# EAGLE board AniBike_v2.6_MainBoard (EAGLE 5.08)
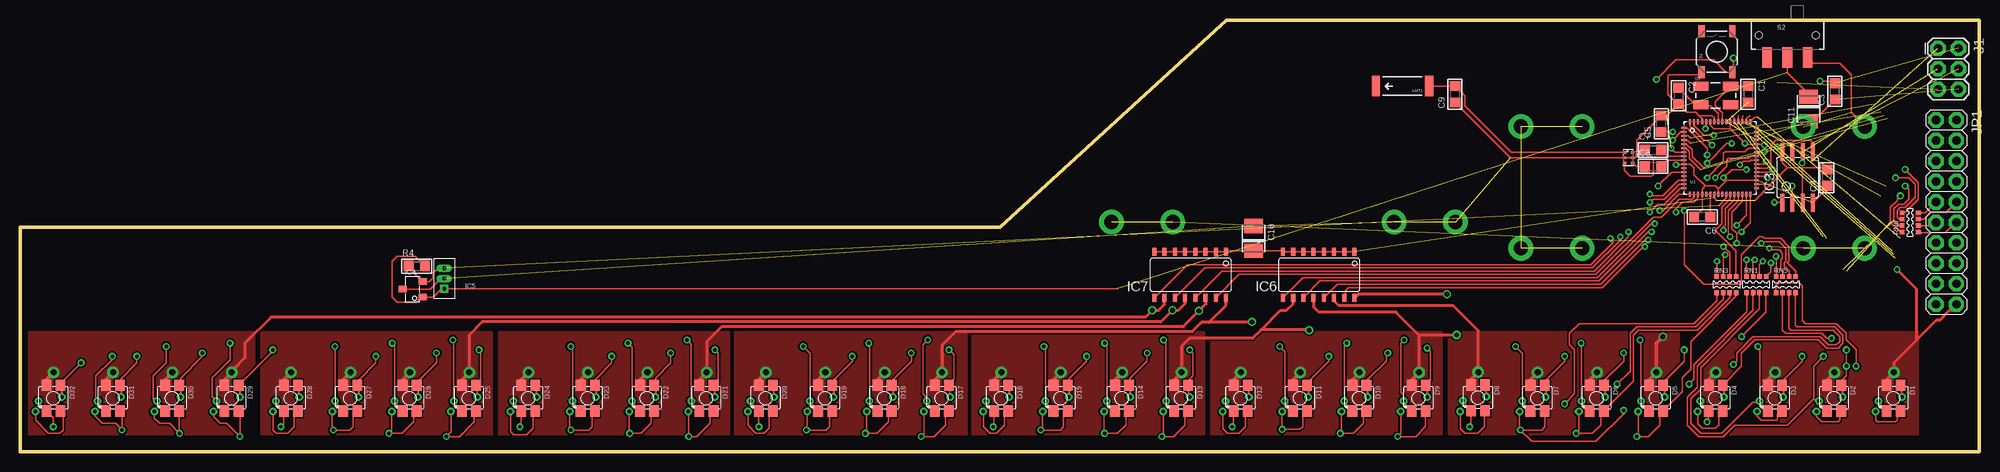
[diagram p5: board, top side]
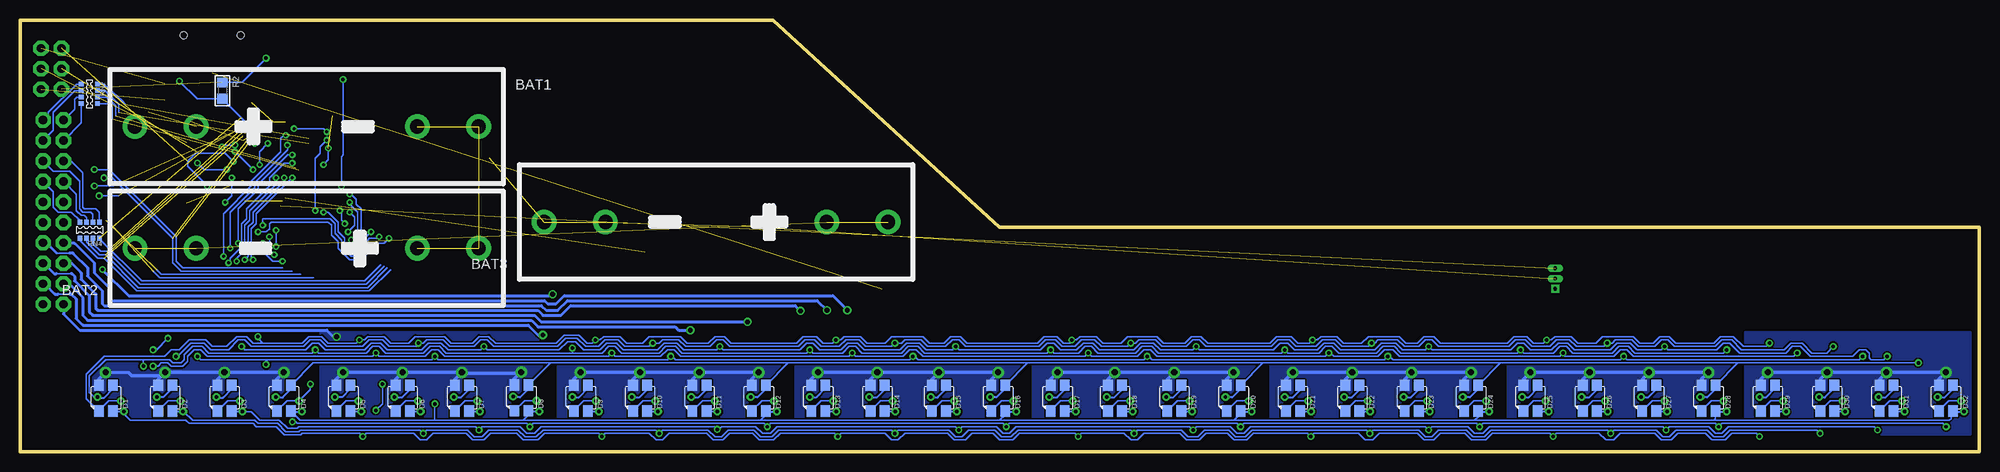
[diagram p6: board, bottom side, seen from below]

Size 243.13 x 53.54 mm. Coordinates in mm from the lower left corner, seen from the top.
Outline: 243.13,0 0,0 0,27.84 121.56,27.84 149.71,53.54 243.13,53.54 243.13,0
Copper layers (1*16): Top 0.035mm / dielectric 1.5mm / Bottom 0.035mm
Design rules "default *": minimum track width 7mil, minimum drill 15mil, track to track 8mil, track to pad 8mil, pad to pad 8mil, via to via 8mil, smd to smd 8mil, copper to edge 10mil, drill to drill 15mil, minimum pad ring 10mil, minimum via ring 8mil, stop-mask expansion 4mil, vias tented up to drill 0mil, thermal gap 10mil

## Footprints (pad centres in the part's own frame; a part is rotated, then mirrored left to right if it is on the bottom)
ANTENNA-CHIP5 = smd 1.016 x 2.54: FEED -3.302,0; NC 3.302,0
BALUN = smd 0.27 x 0.4: 1 -0.7,-0.5; 2 -0.05,-0.5; 3 0.6,-0.5; 4 0.6,0.5; 5 -0.05,0.5; 6 -0.7,0.5
BATTERY_AAA = drill 1.778 pad 3.048 round: MINUS1 21.336,0; MINUS2 13.716,0; PLUS1 -21.336,0; PLUS2 -13.716,0
C0805 = smd 1.2 x 1.3: 1 -1.016,0; 2 1.016,0
C3528-21/T = smd 1.778 x 2.286: + 1.524,0; - -1.524,0
LED1210_DS = drill 0.432 pad 0.889 round: 1 -1.913,-0.353; 2 -2.25,-1.68; 3 1,0.15 | smd 1.2 x 1.4 bottom: 1_BOTTOM 0.85,-1.6; 2_BOTTOM -0.9,-1.6; 3_BOTTOM -0.9,1.6; 4_BOTTOM 0.85,1.6 | smd 1.2 x 1.4: 1_TOP -0.9,-1.6; 2_TOP 0.85,-1.6; 3_TOP 0.85,1.6; 4_TOP -0.9,1.6 | drill 0.762 pad 1.422 round: 4 0,3.2
SOIC8 = smd 0.5 x 2.2: 1 -1.905,-3.154; 2 -0.645,-3.154; 3 0.625,-3.154; 4 1.895,-3.154; 5 1.905,3.154; 6 0.635,3.154; 7 -0.635,3.154; 8 -1.905,3.154
HALL_SENSOR_SE = smd 1 x 0.8: 1 1.15,-1; 2 1.15,0.9; 3 -1.35,-0.05
HALL_SENSOR_UA = drill 0.45 square: 1 0,-1.27 | drill 0.45 long: 2 0,0; 3 0,1.27
SOIC16 = smd 0.5 x 1: 1 -4.41,-2.84; 2 -3.14,-2.84; 3 -1.87,-2.84; 4 -0.6,-2.84; 5 0.67,-2.84; 6 1.94,-2.84; 7 3.21,-2.84; 8 4.48,-2.84; 9 4.48,2.84; 10 3.21,2.84; 11 1.94,2.84; 12 0.67,2.84; 13 -0.6,2.84; 14 -1.87,2.84; 15 -3.14,2.84; 16 -4.41,2.84
2X3 = drill 1.016 pad 1.88 octagon: 1 0,0; 2 0,2.54; 3 2.54,0; 4 2.54,2.54; 5 5.08,0; 6 5.08,2.54
2X10 = drill 1.016 pad 1.88 octagon: 1 -11.43,-1.27; 2 -11.43,1.27; 3 -8.89,-1.27; 4 -8.89,1.27; 5 -6.35,-1.27; 6 -6.35,1.27; 7 -3.81,-1.27; 8 -3.81,1.27; 9 -1.27,-1.27; 10 -1.27,1.27; 11 1.27,-1.27; 12 1.27,1.27; 13 3.81,-1.27; 14 3.81,1.27; 15 6.35,-1.27; 16 6.35,1.27; 17 8.89,-1.27; 18 8.89,1.27; 19 11.43,-1.27; 20 11.43,1.27
CRYSTAL-SMD-5X3 = smd 1.9 x 1.1: 1 -1.85,-1.15; 2 1.85,-1.15; 3 1.85,1.15; 4 -1.85,1.15
R0805 = smd 1.2 x 1.3: 1 -1.016,0; 2 1.016,0
YCTC164 = smd 0.559 x 0.6: P$1 -1.2,-1.003; P$2 -0.4,-1.003; P$3 0.4,-1.003; P$4 1.2,-1.003; P$5 1.2,1.003; P$6 0.4,1.003; P$7 -0.4,1.003; P$8 -1.2,1.003
TACTILE_SWITCH_SMD = smd 1.524 x 0.762: 1 -2.54,1.905; 2 2.54,1.905; 3 -2.54,-1.905; 4 2.54,-1.905
SWITCH-SPDT-SMD = smd 1.2 x 2.5: 1 -2.5,-2.75; 2 0,-2.75; 3 2.5,-2.75 | hole 0.9: -3.55,0; 3.55,0
QFN-64 = smd 0.6 x 0.25: 1 -4.5,3.75; 2 -4.5,3.25; 3 -4.5,2.75; 4 -4.5,2.25; 5 -4.5,1.75; 6 -4.5,1.25; 7 -4.5,0.75; 8 -4.5,0.25; 9 -4.5,-0.25; 10 -4.5,-0.75; 11 -4.5,-1.25; 12 -4.5,-1.75; 13 -4.5,-2.25; 14 -4.5,-2.75; 15 -4.5,-3.25; 16 -4.5,-3.75; 33 4.5,-3.75; 34 4.5,-3.25; 35 4.5,-2.75; 36 4.5,-2.25; 37 4.5,-1.75; 38 4.5,-1.25; 39 4.5,-0.75; 40 4.5,-0.25; 41 4.5,0.25; 42 4.5,0.75; 43 4.5,1.25; 44 4.5,1.75; 45 4.5,2.25; 46 4.5,2.75; 47 4.5,3.25; 48 4.5,3.75 | smd 0.25 x 0.6: 17 -3.75,-4.5; 18 -3.25,-4.5; 19 -2.75,-4.5; 20 -2.25,-4.5; 21 -1.75,-4.5; 22 -1.25,-4.5; 23 -0.75,-4.5; 24 -0.25,-4.5; 25 0.25,-4.5; 26 0.75,-4.5; 27 1.25,-4.5; 28 1.75,-4.5; 29 2.25,-4.5; 30 2.75,-4.5; 31 3.25,-4.5; 32 3.75,-4.5; 49 3.75,4.5; 50 3.25,4.5; 51 2.75,4.5; 52 2.25,4.5; 53 1.75,4.5; 54 1.25,4.5; 55 0.75,4.5; 56 0.25,4.5; 57 -0.25,4.5; 58 -0.75,4.5; 59 -1.25,4.5; 60 -1.75,4.5; 61 -2.25,4.5; 62 -2.75,4.5; 63 -3.25,4.5; 64 -3.75,4.5

## Placement (x,y rotation side)
ANT1  ANTENNA2SMD5  [ANTENNA-CHIP5]  171.55,45.36 180 top
B1  BALUN0805  [BALUN]  199.59,36.42 270 top
BAT1  BATTERY_AAA  [BATTERY_AAA]  207.57,40.34 0 bottom
BAT2  BATTERY_AAA  [BATTERY_AAA]  207.57,25.25 180 bottom
BAT3  BATTERY_AAA  [BATTERY_AAA]  156.77,28.5 180 bottom
C1  12pF  [C0805]  214.43,44.35 270 top
C2  12pF  [C0805]  205.79,44.15 270 top
C3  1uF  [C0805]  225.2,44.7 90 top
C4  1uF  [C0805]  224.21,34.01 90 top
C5  1uF  [C0805]  203.66,40.69 90 top
C6  1uF  [C0805]  208.74,29.11 180 top
C7  22pF  [C0805]  202.64,37.44 0 top
C8  22pF  [C0805]  202.64,35.41 0 top
C9  0.47pF  [C0805]  178.05,44.35 90 top
C10  22uF  [C3528-21/T]  153.06,26.47 270 top
C11  47uF  [C3528-21/T]  221.95,42.52 90 top
D1  LED_RGB_DS  [LED1210_DS]  232.51,6.65 0 top
D2  LED_RGB_DS  [LED1210_DS]  225.15,6.65 0 top
D3  LED_RGB_DS  [LED1210_DS]  217.78,6.65 0 top
D4  LED_RGB_DS  [LED1210_DS]  210.41,6.65 0 top
D5  LED_RGB_DS  [LED1210_DS]  203.05,6.65 0 top
D6  LED_RGB_DS  [LED1210_DS]  195.68,6.65 0 top
D7  LED_RGB_DS  [LED1210_DS]  188.32,6.65 0 top
D8  LED_RGB_DS  [LED1210_DS]  180.95,6.68 0 top
D9  LED_RGB_DS  [LED1210_DS]  173.58,6.65 0 top
D10  LED_RGB_DS  [LED1210_DS]  166.22,6.65 0 top
D11  LED_RGB_DS  [LED1210_DS]  158.85,6.65 0 top
D12  LED_RGB_DS  [LED1210_DS]  151.49,6.65 0 top
D13  LED_RGB_DS  [LED1210_DS]  144.12,6.65 0 top
D14  LED_RGB_DS  [LED1210_DS]  136.75,6.65 0 top
D15  LED_RGB_DS  [LED1210_DS]  129.13,6.65 0 top
D16  LED_RGB_DS  [LED1210_DS]  121.77,6.65 0 top
D17  LED_RGB_DS  [LED1210_DS]  114.4,6.65 0 top
D18  LED_RGB_DS  [LED1210_DS]  107.29,6.65 0 top
D19  LED_RGB_DS  [LED1210_DS]  99.92,6.65 0 top
D20  LED_RGB_DS  [LED1210_DS]  92.56,6.65 0 top
D21  LED_RGB_DS  [LED1210_DS]  85.19,6.65 0 top
D22  LED_RGB_DS  [LED1210_DS]  77.83,6.65 0 top
D23  LED_RGB_DS  [LED1210_DS]  70.46,6.65 0 top
D24  LED_RGB_DS  [LED1210_DS]  63.09,6.65 0 top
D25  LED_RGB_DS  [LED1210_DS]  55.73,6.65 0 top
D26  LED_RGB_DS  [LED1210_DS]  48.36,6.65 0 top
D27  LED_RGB_DS  [LED1210_DS]  41,6.65 0 top
D28  LED_RGB_DS  [LED1210_DS]  33.63,6.65 0 top
D29  LED_RGB_DS  [LED1210_DS]  26.26,6.65 0 top
D30  LED_RGB_DS  [LED1210_DS]  18.9,6.65 0 top
D31  LED_RGB_DS  [LED1210_DS]  11.53,6.65 0 top
D32  LED_RGB_DS  [LED1210_DS]  4.17,6.65 0 top
IC3  AT26DF321  [SOIC8]  220.57,34.04 0 top
IC4  HALL_SENSORSMT  [HALL_SENSOR_SE]  48.82,20.22 0 top
IC5  HALL_SENSORTH  [HALL_SENSOR_UA]  52.63,21.49 0 top
IC6  MMPQ2222  [SOIC16]  161.19,21.95 180 top
IC7  MMPQ2222  [SOIC16]  145.24,21.95 180 top
J1  AVR_SPI_PRG_6PTH  [2X3]  238,50.04 270 top
JP1  [2X10]  239.01,29.72 270 top
Q1  16MHz  [CRYSTAL-SMD-5X3]  210.41,44.2 0 top
R2  10K  [R0805]  218.03,44.81 270 bottom
R4  10K  [R0805]  49.23,23.01 0 top
RN1  RESISTOR_ARR4  [YCTC164]  215.44,20.73 0 top
RN2  RESISTOR_ARR4  [YCTC164]  234.54,44.4 270 bottom
RN3  RESISTOR_ARR4  [YCTC164]  211.73,20.73 0 top
RN4  RESISTOR_ARR4  [YCTC164]  234.49,27.48 180 bottom
RN5  RESISTOR_ARR4  [YCTC164]  219.13,20.73 0 top
RN6  RESISTOR_ARR4  [YCTC164]  234.54,28.45 90 top
S1  SWITCH-MOMENTARY-2SMD  [TACTILE_SWITCH_SMD]  210.57,49.63 90 top
S2  [SWITCH-SPDT-SMD]  219.3,51.66 0 top
U1  ATMEGA128RFA1  [QFN-64]  210.97,36.42 0 top

## Tracks (layer width: path | path; a pad name or v marks a point on that pad's centre or on a via)
+3V3  (via drill 0.38, 0.43)  (3 unrouted)
  Top 0.203: IC7.8 IC7.7 IC7.6 IC7.5 IC7.4 IC7.3 IC7.2 IC7.1 149.8,24.94 C10.+ 156.55,24.94 IC6.8 IC6.7 IC6.6 IC6.5 IC6.4 IC6.3 IC6.2 IC6.1 | C4.2 224.03,35.2 221.13,35.2 | 219.3,35.2 221.13,35.2 | 219.3,35.2 218.67,35.84 IC3.8 218.08,37.77 v218.08,37.85 | IC3.3 221.13,30.95 221.13,35.2 | U1.34 217.27,33.17 | 219.3,35.2 217.27,33.17 | 212.22,40.05 U1.54 | 212.22,40.05 v214.02,38.25 214.1,38.17 U1.44 216.33,38.17 v216.46,38.05 | 212.22,40.05 212.19,40.08 210.16,40.08 209.72,40.52 U1.59 | U1.23 210.22,31.48 210.57,31.14 | 217.27,33.17 215.24,31.14 | v223.37,45.97 224.94,45.97 C3.2
  Bottom 0.203: v214.02,38.25 214.02,39.78 R2.2 221.18,43.79 v223.37,45.97 | v216.46,38.05 217.88,38.05 v218.08,37.85
+5V  (1 unrouted)
  Top 0.203: 136.19,20.22 IC5.1 52.32,20.22 51.26,19.15 50.04,19.15 IC4.1 49.9,19.22 49.22,18.54 46.79,18.54 46.18,19.15 46.18,23.62 46.79,24.23 49.02,24.23 R4.2 | S2.2 219.3,46.99 221.94,44.35 C11.+
CS  (via drill 0.38)
  Top 0.203: U1.36 216.68,34.17 v216.86,33.99 | v217.68,30.94 218.61,30.94 IC3.1
  Bottom 0.203: v216.86,33.99 216.86,31.75 v217.68,30.94
GND  (via drill 0.38)  (11 unrouted)
  Top 0.203: IC4.3 50.85,20.17 52.17,21.49 IC5.2 | C2.2 206.81,42.11 207.92,42.11 208.33,41.71 | 208.33,41.71 208.72,41.32 U1.61 | S1.1 208.36,46.79 204.67,46.79 204.47,46.58 204.47,44.35 205.69,43.13 C2.2 | C4.1 224.21,32.62 IC3.4 | C9.1 184.91,36.47 B1.2 B1.5 200.46,36.47 200.61,36.63 200.61,38.66 C5.2 204.37,41.71 C2.2 | 210.72,32.61 U1.24 | 210.72,32.61 210.36,32.97 209.14,32.97 | 209.14,32.97 208.72,32.55 U1.20 208.72,30.11 C6.2 | 209.14,32.97 207.72,34.39 207.72,35.2 207.25,35.67 U1.10 206.41,35.61 v205.49,35.61 | U1.35 211.79,33.67 210.72,32.61 | U1.58 210.22,41.44 209.96,41.71 208.33,41.71 | C11.- 222.5,41 C3.1 | U1.7 205.35,37.17 v204.88,37.64
  Bottom 0.203: v204.88,37.64 204.88,36.22 v205.49,35.61
INT_SENSOR  (1 unrouted)
  Top 0.203: IC5.3 52.48,22.61 51.66,22.61 51.26,22.2 51.26,21.59 50.79,21.12 IC4.2 48.21,22.88 R4.1 | U1.26 211.72,31.48 210.77,30.53
L1_B1  (via drill 0.38)
  Top 0.203: 217.93,22.45 RN5.P$8 217.93,24.19 v217.88,24.23 | U1.63 207.72,40.49 208.94,39.27 v210.16,39.27
  Bottom 0.203: v210.16,39.27 210.36,39.27 210.77,38.86 210.77,37.24 214.43,33.58 214.43,32.97 217.88,29.51 v217.88,24.23
L1_B1_LED  (via drill 0.43)
  Top 0.203: 204.05,8.1 204.05,8.77 206.5,11.23 v206.5,12.65 | D29.3_TOP 31.34,12.48 v31.34,12.65 | v56.95,12.65 57.15,12.45 57.15,8.79 56.62,8.25 D25.3_TOP 56.73,8.1 D25.3 | v86.21,12.65 86.61,12.24 86.61,8.99 86.04,8.42 D21.3_TOP 86.19,8.1 D21.3 | v115.26,12.65 115.87,12.04 115.87,8.99 115.25,8.37 D17.3_TOP 115.4,8.1 D17.3 | v145.14,12.65 145.54,12.24 145.54,9.4 144.97,8.83 D13.3_TOP 144.97,6.95 D13.3 | v174.6,12.85 175.01,12.45 175.01,8.99 174.43,8.42 D9.3_TOP | D1.3_TOP 233.4,8.25 | v227.84,10.62 227.84,12.65 226.62,13.87 226.62,14.68 225.4,15.9 221.54,15.9 221.13,16.31 221.13,20.57 220.73,20.98 218.26,20.98 217.88,20.57 217.88,20.17 RN5.P$1
  Top 0.254: D1.3 233.51,8.1 D1.3_TOP | D5.3 204.05,8.1 D5.3_TOP | D9.3 174.58,8.1 D9.3_TOP | D29.3_TOP 27.26,8.1 D29.3
  Bottom 0.203: v31.34,12.65 31.75,12.24 42.72,12.24 43.54,13.06 44.75,13.06 45.57,12.24 50.44,12.24 51.26,13.06 52.07,13.06 52.88,12.24 56.54,12.24 v56.95,12.65 57.35,12.24 71.78,12.24 72.59,13.06 74.02,13.06 74.83,12.24 79.5,12.24 80.31,13.06 81.13,13.06 81.94,12.24 85.8,12.24 v86.21,12.65 86.61,12.24 101.85,12.24 102.67,13.06 103.89,13.06 104.7,12.24 109.37,12.24 110.18,13.06 111,13.06 111.81,12.24 114.86,12.24 v115.26,12.65 115.67,12.24 130.91,12.24 131.72,13.06 132.94,13.06 133.76,12.24 138.63,12.24 139.45,13.06 140.26,13.06 141.07,12.24 144.73,12.24 v145.14,12.65 145.54,12.24 160.98,12.24 161.8,13.06 163.02,13.06 163.83,12.24 168.5,12.24 169.32,13.06 170.13,13.06 170.94,12.24 174.6,12.24 | 174.6,12.24 v174.6,12.85 | 174.6,12.24 190.25,12.24 191.06,13.06 192.28,13.06 193.09,12.24 197.76,12.24 198.58,13.06 199.39,13.06 200.2,12.24 206.1,12.24 v206.5,12.65 206.91,12.24 219.71,12.24 220.52,13.06 221.74,13.06 222.76,12.04 222.76,11.43 223.16,11.02 224.18,11.02 224.59,11.43 227.84,11.43 | 227.84,11.43 232.51,11.43 234.54,9.4 234.54,7.37 233.98,6.8 D1.3 | 227.84,11.43 v227.84,10.62
  Bottom 0.254: D1.3_BOTTOM 231.61,7.78 232.69,6.71 233.41,6.71 D1.3 | D5.3_BOTTOM 202.15,7.78 203.12,6.81 D5.3 | D9.3_BOTTOM 172.68,7.86 173.79,6.76 174.53,6.76 D9.3 | D13.3_BOTTOM 143.22,7.86 144.32,6.76 145.07,6.76 D13.3 | D17.3_BOTTOM 113.5,7.71 114.45,6.76 115.35,6.76 D17.3 | D21.3_BOTTOM 84.29,7.66 85.19,6.76 86.14,6.76 D21.3 | D25.3_BOTTOM 54.83,7.86 55.93,6.76 56.68,6.76 D25.3 | D29.3_BOTTOM 25.36,7.86 26.47,6.76 27.21,6.76 D29.3
L1_B2  (via drill 0.38)
  Top 0.203: RN5.P$7 218.73,22.37 218.49,22.61 218.49,23.83 218.69,24.03 218.69,24.64 218.29,25.04 217.27,25.04 v217.07,25.25 | U1.64 207.22,40.38 208.94,38.66 209.35,38.66 v209.96,38.05
  Bottom 0.203: v209.96,38.05 209.96,37.44 214.02,33.38 214.02,32.77 217.07,29.72 v217.07,25.25
L1_B2_LED  (via drill 0.43)
  Top 0.203: 19.9,8.1 19.9,9.13 22.61,11.84 v22.61,12.24 | 49.36,8.1 49.36,8.72 51.66,11.02 v51.66,12.24 | 78.83,8.1 78.83,9.13 80.72,11.02 v80.72,12.24 | 108.29,8.1 108.29,8.92 110.59,11.23 v110.59,12.24 | 137.75,8.1 137.75,9.13 139.85,11.23 v139.85,12.24 | 167.22,8.1 167.22,8.92 169.52,11.23 169.52,12.04 v169.72,12.24 | 196.68,8.1 196.68,8.92 198.98,11.23 v198.98,12.24 | 226.15,8.92 226.62,9.4 v226.62,10.62 v226.62,12.65 | RN5.P$2 218.69,20.1 218.69,15.09 219.1,14.68 223.57,14.68 224.18,14.07 v224.79,14.07
  Top 0.254: 226.15,8.1 D2.3 | 226.15,8.1 D2.3_TOP | D6.3 196.68,8.1 D6.3_TOP | D10.3 167.22,8.1 D10.3_TOP | D14.3 137.75,8.1 D14.3_TOP | D18.3 108.29,8.1 D18.3_TOP | D22.3 78.83,8.1 D22.3_TOP | D26.3 49.36,8.1 D26.3_TOP | D30.3 19.9,8.1 D30.3_TOP | 226.15,8.92 226.15,8.1
  Bottom 0.203: v22.61,12.24 23.01,11.84 42.93,11.84 43.74,12.65 44.55,12.65 45.36,11.84 51.46,11.84 51.66,12.04 v51.66,12.24 52.07,11.84 71.98,11.84 72.8,12.65 73.81,12.65 74.62,11.84 80.11,11.84 80.52,12.24 v80.72,12.24 81.13,11.84 102.06,11.84 102.87,12.65 103.68,12.65 104.5,11.84 110.18,11.84 v110.59,12.24 111,11.84 131.11,11.84 131.93,12.65 132.74,12.65 133.55,11.84 139.45,11.84 v139.85,12.24 140.26,11.84 161.19,11.84 162,12.65 162.81,12.65 163.63,11.84 169.32,11.84 v169.72,12.24 170.13,11.84 190.45,11.84 191.26,12.65 192.07,12.65 192.89,11.84 198.58,11.84 v198.98,12.24 199.39,11.84 219.91,11.84 220.73,12.65 221.54,12.65 222.35,11.84 222.35,11.23 222.96,10.62 224.38,10.62 224.79,11.02 225.6,11.02 226.01,10.62 v226.62,10.62 | v224.79,14.07 226.21,12.65 v226.62,12.65
  Bottom 0.254: D2.3_BOTTOM 224.25,7.89 225.32,6.81 D2.3 | D6.3_BOTTOM 194.78,7.71 195.73,6.76 196.63,6.76 D6.3 | D10.3_BOTTOM 165.32,7.71 166.27,6.76 167.17,6.76 D10.3 | D14.3_BOTTOM 135.85,7.71 136.8,6.76 137.7,6.76 D14.3 | D18.3_BOTTOM 106.39,7.71 107.34,6.76 108.24,6.76 D18.3 | D22.3_BOTTOM 76.93,7.71 77.88,6.76 78.78,6.76 D22.3 | D26.3_BOTTOM 47.46,7.71 48.41,6.76 49.31,6.76 D26.3 | D30.3_BOTTOM 18,7.91 19.15,6.76 19.85,6.76 D30.3
L1_B3  (via drill 0.38)
  Top 0.203: RN5.P$6 219.53,22.38 218.9,23.01 218.9,23.42 219.1,23.62 219.1,25.25 218.29,26.06 216.26,26.06 v216.05,25.86 | U1.1 206.82,40.17 209.35,37.64 v209.35,36.83
  Bottom 0.203: v209.35,36.83 209.96,36.83 213.61,33.17 213.61,32.56 216.05,30.12 v216.05,25.86
L1_B3_LED  (via drill 0.43)
  Top 0.203: 12.53,8.1 12.53,9.08 14.48,11.02 v14.48,11.84 | 42,8.1 42,8.87 44.14,11.02 v44.14,11.84 | 71.46,8.1 71.46,9.08 73.41,11.02 v73.41,11.84 | 100.92,8.1 100.92,8.87 103.28,11.23 v103.28,11.84 | 130.13,8.1 130.13,9.03 132.33,11.23 v132.33,11.84 | 159.85,8.1 159.85,8.67 162.41,11.23 v162.41,11.84 | 189.32,8.1 189.32,8.87 191.67,11.23 v191.67,11.84 | 218.78,8.1 218.78,8.87 221.13,11.23 v221.13,11.84 | v212.6,10.82 213,11.23 213,12.24 215.04,14.27 223.37,14.27 224.38,13.26 225.4,13.26 225.81,13.67 225.81,14.27 224.99,15.09 219.71,15.09 219.51,15.29 219.51,20.11 RN5.P$3
  Top 0.254: D3.3 218.78,8.1 D3.3_TOP | D7.3 189.32,8.1 D7.3_TOP | D11.3 159.85,8.1 D11.3_TOP | D15.3 130.13,8.1 D15.3_TOP | D19.3 100.92,8.1 D19.3_TOP | D23.3 71.46,8.1 D23.3_TOP | D27.3 42,8.1 D27.3_TOP | D31.3 12.53,8.1 D31.3_TOP
  Bottom 0.203: v14.48,11.84 14.88,11.43 43.74,11.43 v44.14,11.84 44.55,11.43 72.8,11.43 73.2,11.84 v73.41,11.84 73.81,11.43 102.67,11.43 103.07,11.84 v103.28,11.84 103.68,11.43 131.72,11.43 132.13,11.84 v132.33,11.84 132.74,11.43 161.8,11.43 162.2,11.84 v162.41,11.84 162.81,11.43 191.26,11.43 v191.67,11.84 192.07,11.43 212.39,11.43 | 212.39,11.43 220.73,11.43 v221.13,11.84 | v212.6,10.82 212.6,11.23 212.39,11.43
  Bottom 0.254: D3.3_BOTTOM 216.88,7.78 217.96,6.71 218.68,6.71 D3.3 | D7.3_BOTTOM 187.42,7.76 188.42,6.76 189.27,6.76 D7.3 | D11.3_BOTTOM 157.95,7.76 158.95,6.76 159.8,6.76 D11.3 | D15.3_BOTTOM 128.23,7.81 129.29,6.76 130.08,6.76 D15.3 | D19.3_BOTTOM 99.02,7.76 100.02,6.76 100.87,6.76 D19.3 | D23.3_BOTTOM 69.56,7.76 70.56,6.76 71.41,6.76 D23.3 | D27.3_BOTTOM 40.1,7.76 41.1,6.76 41.95,6.76 D27.3 | D31.3_BOTTOM 10.63,7.76 11.63,6.76 12.48,6.76 D31.3
L1_B4  (via drill 0.38)
  Top 0.203: RN5.P$5 220.33,22.4 219.3,23.42 219.51,23.62 219.51,25.45 218.49,26.47 216.46,26.47 216.26,26.67 215.85,26.67 213.61,24.43 213.61,20.78 208.94,20.78 206.5,23.22 v206.5,29.92 | U1.2 206.09,39.67 v205.08,38.66
  Bottom 0.203: v206.5,29.92 206.5,36.42 205.89,37.03 205.89,37.85 v205.08,38.66
L1_B4_LED  (via drill 0.43)
  Top 0.203: 5.17,8.1 5.17,8.62 v7.57,11.02 | D4.3_TOP 213.61,10.61 213.61,12.24 215.24,13.87 223.16,13.87 224.18,12.85 225.6,12.85 226.21,13.46 226.21,14.48 225.2,15.49 220.52,15.49 220.32,15.7 220.32,20.12 RN5.P$4
  Top 0.254: D4.3 211.41,8.1 D4.3_TOP | D8.3 181.95,8.13 D8.3_TOP | D12.3 152.49,8.1 D12.3_TOP | D16.3 122.77,8.1 D16.3_TOP | D20.3 93.56,8.1 D20.3_TOP | D24.3 64.09,8.1 D24.3_TOP | D32.3 5.17,8.1 D32.3_TOP | D28.3_TOP 34.63,8.1 D28.3
  Bottom 0.203: 29.96,11.02 v7.57,11.02 | 29.96,11.02 D28.3_BOTTOM | 59.42,11.02 29.96,11.02 | 59.42,11.02 D24.3_BOTTOM | 88.89,11.02 59.42,11.02 | 88.89,11.02 D20.3_BOTTOM | 118.1,11.02 88.89,11.02 | 118.1,11.02 D16.3_BOTTOM | 147.82,11.02 118.1,11.02 | 147.82,11.02 D12.3_BOTTOM | 177.31,11.02 147.82,11.02 | 177.31,11.02 D8.3_BOTTOM | 177.31,11.02 206.74,11.02 D4.3_BOTTOM
  Bottom 0.254: D4.3_BOTTOM 209.51,7.78 210.54,6.76 211.36,6.76 D4.3 | D8.3_BOTTOM 180.05,7.81 181.1,6.76 181.88,6.76 D8.3 | D12.3_BOTTOM 150.59,7.81 151.64,6.76 152.44,6.76 D12.3 | D16.3_BOTTOM 120.87,7.86 121.97,6.76 122.72,6.76 D16.3 | D20.3_BOTTOM 91.66,7.81 92.71,6.76 93.51,6.76 D20.3 | D24.3_BOTTOM 62.19,7.81 63.25,6.76 64.04,6.76 D24.3 | D28.3_BOTTOM 32.73,7.81 33.78,6.76 34.58,6.76 D28.3 | D32.3_BOTTOM 3.27,7.81 4.32,6.76 5.12,6.76 D32.3
L1_G1
  Top 0.203: U1.27 212.22,31.37 211.18,30.33 211.18,28.3 210.36,27.48 212.93,24.91 RN3.P$5
L1_G1_LED  (via drill 0.43)
  Top 0.203: 27.18,5.23 27.28,5.13 v27.28,1.88 25.65,3.51 24.84,3.51 24.01,4.33 D29.2 | 27.18,5.23 27.11,5.3 | D25.2 53.48,2.47 v52.88,1.88 54.51,1.88 56.34,3.71 56.34,4.81 D25.2_TOP | D21.2 82.94,1.89 v82.96,1.88 83.97,1.88 85.6,3.51 85.6,4.61 D21.2_TOP | D17.2 112.15,2.22 v111.81,1.88 113.44,1.88 114.86,3.3 114.86,4.66 D17.2_TOP | D13.2 141.87,2.07 v141.68,1.88 143.1,1.88 144.53,3.3 144.53,4.61 D13.2_TOP | D9.2 171.33,2.27 v170.94,1.88 173.18,1.88 174.4,3.1 174.4,5.02 D9.2_TOP | D5.2 200.8,2.07 v200.61,1.88 202.03,1.88 203.45,3.3 203.45,4.61 D5.2_TOP 206.3,7.46 206.3,9.19 207.31,10.21 207.31,13.67 212.93,19.28 RN3.P$4 | D1.2_TOP 232.92,4.61 232.92,3.91 232.71,3.71 230.48,3.71 230.26,3.93 D1.2 | D29.2_TOP 27.11,5.17 27.18,5.23
  Bottom 0.203: v27.28,1.88 27.69,2.29 30.73,2.29 31.55,1.47 33.17,1.47 33.98,2.29 37.44,2.29 38.25,1.47 39.47,1.47 40.28,2.29 44.55,2.29 45.36,1.47 46.38,1.47 47.19,2.29 52.48,2.29 v52.88,1.88 53.29,2.29 60.4,2.29 61.21,1.47 63.04,1.47 63.86,2.29 66.9,2.29 67.72,1.47 68.94,1.47 69.75,2.29 74.42,2.29 75.23,1.47 76.25,1.47 77.06,2.29 82.55,2.29 v82.96,1.88 83.36,2.29 90.07,2.29 90.88,1.47 92.51,1.47 93.32,2.29 95.96,2.29 96.77,1.47 98.4,1.47 99.21,2.29 103.68,2.29 104.5,1.47 105.31,1.47 106.12,2.29 111.4,2.29 v111.81,1.88 112.22,2.29 119.13,2.29 119.94,1.47 121.56,1.47 122.38,2.29 125.02,2.29 125.83,1.47 127.25,1.47 128.07,2.29 133.35,2.29 134.16,1.47 134.98,1.47 135.79,2.29 141.27,2.29 v141.68,1.88 142.09,2.29 148.79,2.29 149.61,1.47 151.43,1.47 152.25,2.29 155.09,2.29 155.9,1.47 157.12,1.47 157.94,2.29 162.61,2.29 163.42,1.47 164.24,1.47 165.05,2.29 170.54,2.29 v170.94,1.88 171.35,2.29 178.05,2.29 178.87,1.47 180.7,1.47 181.51,2.29 184.76,2.29 185.57,1.47 186.99,1.47 187.81,2.29 191.87,2.29 192.68,1.47 193.5,1.47 194.31,2.29 200.2,2.29 v200.61,1.88 201.02,2.29 208.13,2.29 208.33,2.08 210.36,2.08 211.38,3.1 213.82,3.1 214.22,3.51 222.15,3.51 222.55,3.91 229.46,3.91 230.26,4.71 D1.2
  Bottom 0.254: D29.2 25.28,4.97 D29.2_BOTTOM | D25.2 54.75,4.97 D25.2_BOTTOM | D21.2 84.21,4.97 D21.2_BOTTOM | D17.2 113.42,4.97 D17.2_BOTTOM | D13.2 143.14,4.97 D13.2_BOTTOM | D9.2 172.6,4.97 D9.2_BOTTOM | D5.2 202.07,4.97 D5.2_BOTTOM | D1.2 231.53,4.97 D1.2_BOTTOM
L1_G2  (via drill 0.38)
  Top 0.203: U1.28 212.72,31.26 211.58,30.12 211.58,28.09 211.38,27.89 v211.38,27.48 | v211.38,25.45 212.13,24.7 RN3.P$6
  Bottom 0.203: v211.38,27.48 v211.38,25.45
L1_G2_LED  (via drill 0.43)
  Top 0.203: 19.75,5.35 19.76,5.33 19.76,5.07 | 19.76,5.07 v19.76,2.29 18.54,3.51 17.32,3.51 16.65,4.18 D30.2 | D26.2 46.11,2.63 v45.77,2.29 47.4,2.29 48.82,3.71 48.82,4.66 D26.2_TOP | D22.2 75.58,2.35 v75.64,2.29 77.06,2.29 78.28,3.51 78.28,4.66 D22.2_TOP | D18.2 105.04,2.42 v104.9,2.29 106.32,2.29 107.75,3.71 107.75,4.66 D18.2_TOP | D14.2 134.5,2.35 v134.57,2.29 136.19,2.29 137.21,3.3 137.21,4.66 D14.2_TOP | D10.2 163.97,2.42 v163.83,2.29 165.46,2.29 166.67,3.51 166.67,4.66 D10.2_TOP | D6.2 193.43,2.63 v193.09,2.29 195.12,2.29 196.14,3.3 196.14,4.66 D6.2_TOP 200.2,8.73 200.2,14.48 200.81,15.09 208.13,15.09 212.13,19.09 RN3.P$3 | D2.2_TOP 225.81,4.87 225.81,3.91 225.6,3.71 223.57,3.71 222.9,4.38 D2.2 | 19.76,5.07 D30.2_TOP
  Bottom 0.203: v19.76,2.29 20.17,2.69 30.94,2.69 31.75,1.88 32.97,1.88 33.78,2.69 37.64,2.69 38.46,1.88 39.27,1.88 40.08,2.69 45.36,2.69 v45.77,2.29 46.18,2.69 60.6,2.69 61.42,1.88 62.84,1.88 63.65,2.69 67.11,2.69 67.92,1.88 68.73,1.88 69.54,2.69 75.23,2.69 v75.64,2.29 76.05,2.69 90.27,2.69 91.08,1.88 92.3,1.88 93.12,2.69 96.16,2.69 96.98,1.88 98.2,1.88 99.01,2.69 104.5,2.69 v104.9,2.29 105.31,2.69 119.33,2.69 120.14,1.88 121.36,1.88 122.17,2.69 125.42,2.69 126.24,1.88 127.05,1.88 127.86,2.69 134.16,2.69 v134.57,2.29 134.98,2.69 149,2.69 149.81,1.88 151.23,1.88 152.04,2.69 155.3,2.69 156.11,1.88 156.92,1.88 157.73,2.69 163.42,2.69 v163.83,2.29 164.24,2.69 178.26,2.69 179.07,1.88 180.49,1.88 181.3,2.69 184.96,2.69 185.78,1.88 186.79,1.88 187.6,2.69 192.68,2.69 v193.09,2.29 193.5,2.69 208.33,2.69 208.53,2.49 210.16,2.49 211.18,3.51 213.61,3.51 214.02,3.91 221.74,3.91 222.8,4.97 D2.2
  Bottom 0.254: D30.2 17.92,4.97 D30.2_BOTTOM | D26.2 47.38,4.97 D26.2_BOTTOM | D22.2 76.85,4.97 D22.2_BOTTOM | D18.2 106.31,4.97 D18.2_BOTTOM | D14.2 135.77,4.97 D14.2_BOTTOM | D10.2 165.24,4.97 D10.2_BOTTOM | D6.2 194.7,4.97 D6.2_BOTTOM | D2.2 224.17,4.97 D2.2_BOTTOM
L1_G3  (via drill 0.38)
  Top 0.203: U1.29 213.22,31.16 211.99,29.92 211.99,26.87 v212.19,26.67 | v211.58,24.43 211.33,24.19 RN3.P$7
  Bottom 0.203: v212.19,26.67 212.19,24.84 211.78,24.43 v211.58,24.43
L1_G3_LED  (via drill 0.43)
  Top 0.203: 12.45,5.13 12.65,4.93 v12.65,2.69 11.84,3.51 10.21,3.51 9.28,4.43 D31.2 | 12.45,5.13 12.38,5.2 | D27.2 38.75,2.81 v38.86,2.69 40.89,2.69 41.3,3.1 41.3,4.51 D27.2_TOP | D23.2 68.21,2.81 v68.33,2.69 70.56,2.69 70.97,3.1 70.97,4.71 D23.2_TOP | D19.2 97.67,2.78 v97.59,2.69 100.02,2.69 100.43,3.1 100.43,4.71 D19.2_TOP | D15.2 126.88,2.93 v126.64,2.69 129.08,2.69 129.49,3.1 129.49,4.56 D15.2_TOP | D11.2 v156.6,2.78 158.84,2.78 159.16,3.1 159.16,4.51 D11.2_TOP | v186.18,2.69 186.07,2.81 D7.2 | D7.2_TOP 189.23,4.99 189.23,3.1 188.82,2.69 v186.18,2.69 | D3.2_TOP 218.08,4.51 218.08,3.91 216.05,3.91 215.53,4.43 D3.2 | RN3.P$2 211.33,18.9 207.92,15.49 200.61,15.49 199.8,14.68 199.8,10.01 v198.17,8.38 | v198.98,5.13 198.98,4.72 195.53,1.27 187.6,1.27 v186.18,2.69 | D31.2_TOP 12.45,5.12 12.45,5.13
  Bottom 0.203: v12.65,2.69 13.06,3.1 31.14,3.1 31.95,2.29 32.77,2.29 33.58,3.1 38.46,3.1 v38.86,2.69 39.27,3.1 60.81,3.1 61.62,2.29 62.64,2.29 63.45,3.1 67.92,3.1 v68.33,2.69 68.73,3.1 90.47,3.1 91.29,2.29 92.1,2.29 92.91,3.1 97.18,3.1 v97.59,2.69 97.99,3.1 119.53,3.1 120.34,2.29 121.16,2.29 121.97,3.1 126.24,3.1 v126.64,2.69 127.05,3.1 149.2,3.1 150.01,2.29 151.03,2.29 151.84,3.1 156.11,3.1 156.51,2.69 v156.6,2.78 156.92,3.1 178.46,3.1 179.27,2.29 180.29,2.29 181.1,3.1 185.78,3.1 v186.18,2.69 186.59,3.1 208.53,3.1 208.74,2.9 209.96,2.9 210.97,3.91 213.41,3.91 214.47,4.97 D3.2 | v198.17,8.38 198.17,5.94 v198.98,5.13
  Bottom 0.254: D31.2 10.55,4.97 D31.2_BOTTOM | D27.2 40.02,4.97 D27.2_BOTTOM | D23.2 69.48,4.97 D23.2_BOTTOM | D19.2 98.94,4.97 D19.2_BOTTOM | D15.2 128.15,4.97 D15.2_BOTTOM | D11.2 157.87,4.97 D11.2_BOTTOM | D7.2 187.34,4.97 D7.2_BOTTOM | D3.2 216.8,4.97 D3.2_BOTTOM
L1_G4  (via drill 0.38)
  Top 0.203: 210.57,21.76 RN3.P$8 210.53,23.59 v210.57,23.62 | U1.30 213.72,31.05 212.39,29.72 212.39,27.69 213,27.08 v213,25.86
  Bottom 0.203: v213,25.86 212.6,25.45 212.6,24.43 211.78,23.62 v210.57,23.62
L1_G4_LED  (via drill 0.43)
  Top 0.203: D32.2_TOP 5.33,4.74 5.33,2.69 4.93,2.29 3.5,2.29 1.92,3.88 D32.2 | D28.2_TOP 33.98,4.56 33.98,3.1 33.17,2.29 31.75,2.29 31.38,2.66 D28.2 | D24.2_TOP 63.65,4.76 63.65,2.9 62.84,2.08 61.21,2.08 60.84,2.45 D24.2 | D20.2_TOP 92.91,4.56 92.91,2.9 92.3,2.29 91.29,2.29 90.31,3.27 D20.2 | D16.2_TOP 122.17,4.61 122.17,3.3 121.16,2.29 120.34,2.29 119.52,3.11 D16.2 | D12.2_TOP 152.04,4.76 152.04,3.1 151.23,2.29 149.81,2.29 149.24,2.86 D12.2 | D8.2_TOP 181.71,4.99 181.71,3.1 180.9,2.29 179.27,2.29 178.7,2.86 D8.2 | D4.2_TOP 210.77,4.56 210.77,3.3 210.36,2.9 208.74,2.9 208.16,3.47 D4.2 | RN3.P$1 210.53,18.71 207.72,15.9 193.5,15.9 192.28,14.68 192.28,13.26 192.89,12.65 192.89,7.16 v191.67,5.94
  Bottom 0.203: 209.43,4.97 208.37,3.91 191.67,3.91 | 191.67,3.91 180.7,3.91 | 180.7,3.91 180.05,4.56 D8.2_BOTTOM | 180.7,3.91 151.23,3.91 | 151.23,3.91 150.59,4.56 D12.2_BOTTOM | 151.23,3.91 121.56,3.91 | 121.56,3.91 120.87,4.61 D16.2_BOTTOM | 121.56,3.91 92.51,3.91 | 92.51,3.91 91.66,4.76 D20.2_BOTTOM | 92.51,3.91 62.64,3.91 | 62.64,3.91 62.19,4.35 D24.2_BOTTOM | 62.64,3.91 32.97,3.91 | 32.97,3.91 32.77,4.11 32.77,5.02 D28.2_BOTTOM | 32.97,3.91 3.71,3.91 3.5,4.11 3.5,4.82 D32.2_BOTTOM | v191.67,5.94 191.67,3.91
  Bottom 0.254: D32.2 3.19,4.97 D32.2_BOTTOM | D28.2 32.65,4.97 D28.2_BOTTOM | D24.2 62.11,4.97 D24.2_BOTTOM | D20.2 91.58,4.97 D20.2_BOTTOM | D16.2 120.79,4.97 D16.2_BOTTOM | D12.2 150.51,4.97 D12.2_BOTTOM | D8.2 179.97,5 D8.2_BOTTOM | D4.2 209.43,4.97 D4.2_BOTTOM
L1_R1  (via drill 0.38)
  Top 0.203: U1.40 214.79,36.17 214.63,36.02 213.82,36.02 v213.41,35.61 | RN1.P$5 217.27,22.36 v217.27,23.42 | v209.35,35.81 211.78,38.25 v212.39,38.25
  Bottom 0.203: v217.27,23.42 217.07,23.62 217.07,24.03 215.65,25.45 215.65,28.3 215.04,28.91 215.04,30.12 212.19,32.97 212.19,33.99 210.36,35.81 v209.35,35.81 | v212.39,38.25 213.41,37.24 v213.41,35.61
L1_R1_LED  (via drill 0.43)
  Top 0.203: D29.1 23.82,6.83 23.82,9.19 26.06,11.43 v26.06,13.46 | v53.7,13.87 53.81,13.75 D25.1 | v82.75,13.87 83.28,13.34 D21.1 | v112.62,13.87 112.01,13.26 112.01,7.16 112.49,6.69 D17.1 | v141.88,13.87 142.21,13.55 D13.1 | v171.75,13.87 171.35,13.46 171.35,7.37 171.67,7.04 D9.1 | v201.02,13.87 201.13,13.75 D5.1 | RN1.P$4 216.64,17.3 v213.61,14.27
  Top 0.254: D29.1 24.35,6.07 D29.1_TOP | D25.1 53.81,6.07 D25.1_TOP | D21.1 83.28,6.07 D21.1_TOP | D17.1 112.49,6.07 D17.1_TOP | D13.1 142.21,6.07 D13.1_TOP | D9.1 171.67,6.07 D9.1_TOP | D5.1 201.13,6.07 D5.1_TOP | D1.1 230.6,6.07 D1.1_TOP
  Bottom 0.203: D29.1_BOTTOM 25.87,6.3 D29.1 | D25.1_BOTTOM 55.33,6.3 D25.1 | D21.1_BOTTOM 84.79,6.3 D21.1 | D17.1_BOTTOM 114,6.3 D17.1 | D13.1_BOTTOM 143.72,6.3 D13.1 | D9.1_BOTTOM 173.19,6.3 D9.1 | D5.1_BOTTOM 202.65,6.3 D5.1 | D1.1 232.11,6.3 D1.1_BOTTOM 233.45,5.05 234.95,6.55 234.95,9.6 232.71,11.84 225.2,11.84 224.38,12.65 223.37,12.65 222.15,13.87 220.12,13.87 219.3,13.06 217.47,13.06 216.26,14.27 215.04,14.27 214.22,13.46 213,13.46 | v26.06,13.46 26.47,13.06 29.31,13.06 30.53,14.27 32.16,14.27 32.97,13.46 37.64,13.46 38.46,14.27 39.67,14.27 40.49,13.46 42.11,13.46 42.93,14.27 46.79,14.27 47.6,13.46 49.83,13.46 50.65,14.27 52.68,14.27 53.09,13.87 v53.7,13.87 54.1,13.46 55.32,13.46 56.13,14.27 57.76,14.27 58.57,13.46 66.9,13.46 67.72,14.27 68.94,14.27 69.75,13.46 71.17,13.46 71.98,14.27 75.84,14.27 76.66,13.46 78.89,13.46 79.7,14.27 81.74,14.27 82.14,13.87 v82.75,13.87 83.16,13.46 84.58,13.46 85.39,14.27 87.22,14.27 88.04,13.46 95.76,13.46 96.57,14.27 97.79,14.27 98.6,13.46 101.24,13.46 102.06,14.27 105.71,14.27 106.53,13.46 108.76,13.46 109.58,14.27 111.61,14.27 112.01,13.87 112.42,13.87 | 112.42,13.87 v112.62,13.87 | 112.42,13.87 112.83,13.46 113.64,13.46 114.45,14.27 116.08,14.27 116.89,13.46 125.63,13.46 126.44,14.27 127.66,14.27 128.47,13.46 130.3,13.46 131.11,14.27 134.98,14.27 135.79,13.46 138.02,13.46 138.84,14.27 140.87,14.27 141.27,13.87 v141.88,13.87 142.29,13.46 143.51,13.46 144.32,14.27 145.95,14.27 146.76,13.46 154.89,13.46 155.7,14.27 156.92,14.27 157.73,13.46 160.38,13.46 161.19,14.27 165.05,14.27 165.86,13.46 167.89,13.46 168.71,14.27 170.74,14.27 171.14,13.87 v171.75,13.87 172.16,13.46 172.77,13.46 173.79,14.48 175.62,14.48 176.63,13.46 184.15,13.46 184.96,14.27 186.18,14.27 186.99,13.46 189.64,13.46 190.45,14.27 194.11,14.27 194.92,13.46 197.15,13.46 197.97,14.27 200,14.27 200.41,13.87 v201.02,13.87 201.42,13.46 204.88,13.46 205.69,14.27 207.31,14.27 208.13,13.46 213,13.46
  Bottom 0.203: v213.61,14.27 213.61,14.07 213,13.46
L1_R2  (via drill 0.38)
  Top 0.203: U1.41 214.68,36.67 214.43,36.42 211.99,36.42 211.78,36.22 211.78,35.41 v210.36,33.99 | RN1.P$7 215.04,23.42 215.24,23.62 v215.24,23.83
  Bottom 0.203: v215.24,23.83 214.83,24.23 214.83,27.89 214.22,28.5 214.22,29.72 210.36,33.58 v210.36,33.99
L1_R2_LED  (via drill 0.43)
  Top 0.203: 16.98,6.07 16.51,6.54 16.51,9.4 18.14,11.02 v18.14,13.06 | v46.18,13.46 46.45,13.19 D26.1 | v75.44,13.46 75.91,12.99 D22.1 | v105.31,13.46 105.38,13.39 D18.1 | v134.57,13.46 134.84,13.19 D14.1 | v164.64,13.46 164.3,13.19 D10.1 | v193.7,13.46 193.77,13.39 D6.1 | v223.77,11.84 222.55,10.62 222.55,6.55 | 222.55,6.55 222.81,6.3 D2.1 | 222.55,6.55 219.3,3.3 212.8,3.3 211.38,1.88 208.33,1.88 206.91,3.3 206.91,6.76 208.13,7.98 208.13,10.62 215.04,17.53 215.04,20.12 RN1.P$2
  Top 0.254: D30.1 16.98,6.07 D30.1_TOP | D26.1 46.45,6.07 D26.1_TOP | D22.1 75.91,6.07 D22.1_TOP | D18.1 105.38,6.07 D18.1_TOP | D14.1 134.84,6.07 D14.1_TOP | D10.1 164.3,6.07 D10.1_TOP | D6.1 193.77,6.07 D6.1_TOP | D2.1 223.23,6.07 D2.1_TOP
  Bottom 0.203: D30.1_BOTTOM 18.5,6.3 D30.1 | D26.1_BOTTOM 47.96,6.3 D26.1 | D22.1_BOTTOM 77.43,6.3 D22.1 | D18.1_BOTTOM 106.89,6.3 D18.1 | D14.1_BOTTOM 136.36,6.3 D14.1 | D10.1_BOTTOM 165.82,6.3 D10.1 | D6.1_BOTTOM 195.28,6.3 D6.1 | D2.1_BOTTOM 224.75,6.3 D2.1 | v18.14,13.06 18.95,12.24 20.78,12.24 22,13.46 23.42,13.46 24.23,12.65 29.51,12.65 30.73,13.87 31.95,13.87 32.77,13.06 37.85,13.06 38.66,13.87 39.47,13.87 40.28,13.06 42.32,13.06 43.13,13.87 45.16,13.87 45.57,13.46 v46.18,13.46 46.58,13.06 50.04,13.06 50.85,13.87 52.48,13.87 53.29,13.06 55.52,13.06 56.34,13.87 57.56,13.87 58.37,13.06 67.11,13.06 67.92,13.87 68.73,13.87 69.54,13.06 71.37,13.06 72.19,13.87 74.62,13.87 75.03,13.46 v75.44,13.46 75.84,13.06 79.1,13.06 79.91,13.87 81.53,13.87 82.35,13.06 84.78,13.06 85.6,13.87 87.02,13.87 87.83,13.06 95.96,13.06 96.77,13.87 97.59,13.87 98.4,13.06 101.45,13.06 102.26,13.87 104.29,13.87 104.7,13.46 v105.31,13.46 105.71,13.06 108.97,13.06 109.78,13.87 111.4,13.87 112.22,13.06 113.84,13.06 114.66,13.87 115.87,13.87 116.69,13.06 125.83,13.06 126.64,13.87 127.46,13.87 128.27,13.06 130.5,13.06 131.32,13.87 133.35,13.87 133.76,13.46 v134.57,13.46 134.98,13.06 138.23,13.06 139.04,13.87 140.66,13.87 141.48,13.06 143.71,13.06 144.53,13.87 145.74,13.87 146.56,13.06 155.09,13.06 155.9,13.87 156.72,13.87 157.53,13.06 160.58,13.06 161.39,13.87 163.42,13.87 163.83,13.46 v164.64,13.46 165.05,13.06 168.1,13.06 168.91,13.87 170.54,13.87 171.35,13.06 172.97,13.06 173.99,14.07 175.41,14.07 176.43,13.06 184.35,13.06 185.17,13.87 185.98,13.87 186.79,13.06 189.84,13.06 190.65,13.87 192.68,13.87 193.09,13.46 193.5,13.46
  Bottom 0.203: 193.5,13.46 v193.7,13.46 | 193.5,13.46 193.9,13.06 197.36,13.06 198.17,13.87 199.8,13.87 200.61,13.06 205.08,13.06 205.89,13.87 207.11,13.87 207.92,13.06 214.43,13.06 215.24,13.87 216.05,13.87 217.27,12.65 219.51,12.65 220.32,13.46 221.94,13.46 223.57,11.84 v223.77,11.84
L1_R3  (via drill 0.38)
  Top 0.203: RN1.P$6 215.85,23.22 v216.26,23.62 | v211.38,33.99 212.39,35 v214.22,35 | v216.46,37.24 216.4,37.17 U1.42
  Bottom 0.203: v216.26,23.62 216.26,24.03 215.24,25.04 215.24,28.09 214.63,28.7 214.63,29.92 211.38,33.17 v211.38,33.99 | v216.46,37.24 v214.22,35
L1_R3_LED  (via drill 0.43)
  Top 0.203: D31.1 9.4,6.52 9.4,9.4 11.43,11.43 v11.43,11.84 | v39.06,13.06 39.08,13.04 D27.1 | v68.33,13.06 68.55,12.83 D23.1 | v97.18,13.06 98.01,12.23 D19.1 | v127.05,13.06 127.22,12.89 D15.1 | v156.31,13.06 156.94,12.43 D11.1 | v185.57,13.06 186.4,12.23 D7.1 | v215.65,13.06 215.87,12.83 D3.1 215.71,6.15 215.04,6.15 211.18,2.29 208.53,2.29 207.31,3.51 207.31,6.55 208.53,7.77 208.53,10.41 215.85,17.73 215.85,20.12 RN1.P$3
  Top 0.254: D31.1 9.62,6.07 D31.1_TOP | D27.1 39.08,6.07 D27.1_TOP | D23.1 68.55,6.07 D23.1_TOP | D19.1 98.01,6.07 D19.1_TOP | D15.1 127.22,6.07 D15.1_TOP | D11.1 156.94,6.07 D11.1_TOP | D7.1 186.4,6.07 D7.1_TOP | D3.1 215.87,6.07 D3.1_TOP
  Bottom 0.203: D31.1_BOTTOM 11.13,6.3 D31.1 | D27.1_BOTTOM 40.6,6.3 D27.1 | D23.1_BOTTOM 70.06,6.3 D23.1 | D19.1_BOTTOM 99.53,6.3 D19.1 | D15.1_BOTTOM 128.74,6.3 D15.1 | D11.1_BOTTOM 158.45,6.3 D11.1 | D7.1_BOTTOM 187.92,6.3 D7.1 | D3.1_BOTTOM 217.38,6.3 D3.1 | v11.43,11.84 11.84,11.43 13.46,11.43 13.66,11.63 13.66,12.24 14.07,12.65 14.88,12.65 15.7,11.84 20.98,11.84 22.2,13.06 23.22,13.06 24.03,12.24 29.72,12.24 30.94,13.46 31.75,13.46 32.56,12.65 38.66,12.65 v39.06,13.06 39.47,12.65 42.52,12.65 43.33,13.46 44.96,13.46 45.77,12.65 50.24,12.65 51.05,13.46 52.27,13.46 53.09,12.65 55.73,12.65 56.54,13.46 57.35,13.46 58.17,12.65 67.92,12.65 v68.33,13.06 68.73,12.65 71.58,12.65 72.39,13.46 74.22,13.46 75.03,12.65 79.3,12.65 80.11,13.46 81.33,13.46 82.14,12.65 84.99,12.65 85.8,13.46 86.82,13.46 87.63,12.65 96.77,12.65 v97.18,13.06 97.59,12.65 101.65,12.65 102.46,13.46 104.09,13.46 104.9,12.65 109.17,12.65 109.98,13.46 111.2,13.46 112.01,12.65 114.05,12.65 114.86,13.46 115.67,13.46 116.48,12.65 126.64,12.65 v127.05,13.06 127.46,12.65 130.71,12.65 131.52,13.46 133.15,13.46 133.96,12.65 138.43,12.65 139.24,13.46 140.46,13.46 141.27,12.65 143.92,12.65 144.73,13.46 145.54,13.46 146.35,12.65 155.9,12.65 v156.31,13.06 156.72,12.65 160.78,12.65 161.59,13.46 163.22,13.46 164.03,12.65 168.3,12.65 169.11,13.46 170.33,13.46 171.14,12.65 173.18,12.65 174.19,13.67 175.21,13.67 176.22,12.65 185.17,12.65 v185.57,13.06 185.98,12.65 190.04,12.65 190.86,13.46 192.48,13.46 193.29,12.65 197.56,12.65 198.37,13.46 199.59,13.46 200.41,12.65 205.28,12.65 206.1,13.46 206.91,13.46 207.72,12.65 215.24,12.65 v215.65,13.06
L1_R4  (via drill 0.38)
  Top 0.203: U1.43 214.46,37.67 214.02,37.24 211.58,37.24 211.38,37.03 211.38,36.02 v209.35,33.99 | RN1.P$8 214.22,21.75 v214.22,23.83
  Bottom 0.203: v214.22,23.83 214.43,24.03 214.43,27.69 213.82,28.3 213.82,29.51 v209.35,33.99
L1_R4_LED  (via drill 0.43)
  Top 0.203: 2.94,5.38 4.11,4.21 v4.11,3.1 | v32.36,3.1 32.73,3.47 D28.1_TOP | v62.03,3.1 62.19,3.27 D24.1_TOP | v91.69,3.1 91.66,3.14 D20.1_TOP | v120.75,3.1 120.87,3.21 D16.1_TOP | v150.42,3.1 150.59,3.27 D12.1_TOP | v179.88,3.1 180.05,3.27 D8.1_TOP | v209.35,3.71 209.51,4.08 D4.1_TOP | RN1.P$1 214.24,17.55 214.22,17.32 207.72,10.82 207.72,8.99 v207.11,8.38
  Top 0.254: D32.1 2.25,6.07 2.94,5.38 D32.1_TOP | D28.1 31.72,6.07 D28.1_TOP | D24.1 61.18,6.07 D24.1_TOP | D20.1 90.64,6.07 D20.1_TOP | D16.1 119.85,6.07 D16.1_TOP | D12.1 149.57,6.07 D12.1_TOP | D8.1 179.04,6.09 D8.1_TOP | D4.1 208.5,6.07 D4.1_TOP
  Bottom 0.203: D32.1_BOTTOM 3.77,6.3 D32.1 | D28.1_BOTTOM 33.23,6.3 D28.1 | D24.1_BOTTOM 62.7,6.3 D24.1 | D20.1_BOTTOM 92.16,6.3 D20.1 | D16.1_BOTTOM 121.37,6.3 D16.1 | D12.1_BOTTOM 151.09,6.3 D12.1 | D8.1_BOTTOM 180.55,6.33 D8.1 | D4.1_BOTTOM 210.02,6.3 D4.1 207.11,7.69 v207.11,8.38 | v4.11,3.1 4.52,3.51 31.95,3.51 v32.36,3.1 32.77,3.51 61.62,3.51 v62.03,3.1 62.43,3.51 91.29,3.51 v91.69,3.1 92.1,3.51 120.34,3.51 v120.75,3.1 121.16,3.51 150.01,3.51 v150.42,3.1 150.82,3.51 179.48,3.51 v179.88,3.1 180.29,3.51 208.74,3.51 208.94,3.71 v209.35,3.71
L2_B1  (via drill 0.43)  (2 unrouted)
  Top 0.203: v233.32,31.75 232.92,31.34 232.92,31.14 232.1,30.33 232.1,28.5 233.36,27.25 RN6.P$8 | U1.50 214.22,41.3 214.63,41.71
  Bottom 0.203: 206.7,21.59 225.81,21.59 226.62,22.4 | v233.32,31.75 230.89,31.75
L2_B1_LED
  Top 0.203: RN6.P$1 235.37,27.28 235.51,27.15 238.89,27.15 240.18,28.45 JP1.12
L2_B2  (via drill 0.43)  (2 unrouted)
  Top 0.203: v233.93,32.97 234.34,32.56 234.34,31.34 233.73,30.73 233.12,30.73 232.51,30.12 232.51,28.7 233.17,28.05 RN6.P$7 | U1.51 213.72,41.61 213.82,41.71
  Bottom 0.203: 208.33,22 225.6,22 226.21,22.61 | v233.93,32.97 231.5,32.97
L2_B2_LED
  Top 0.203: RN6.P$2 237.34,28.05 JP1.11
L2_B3  (via drill 0.43)  (1 unrouted)
  Top 0.203: v232.71,33.99 234.34,33.99 235.15,33.17 235.15,31.55 233.93,30.33 233.32,30.33 232.92,29.92 232.92,29.11 233.18,28.85 RN6.P$6 | U1.52 213.22,41.69 213.21,41.71
  Bottom 0.203: 209.35,22.4 223.16,22.4 224.18,23.42 224.18,26.47 231.7,33.99 v232.71,33.99
L2_B3_LED
  Top 0.203: RN6.P$3 236.24,28.85 237.11,29.72 239.01,29.72 JP1.10
L2_B4  (via drill 0.43)  (1 unrouted)
  Top 0.203: v233.93,35 235.56,33.38 235.56,31.32 233.95,29.71 RN6.P$5 | U1.53 212.72,41.38 212.39,41.71
  Bottom 0.203: 210.57,22.81 222.96,22.81 223.77,23.62 223.77,26.67 232.1,35 v233.93,35
L2_B4_LED
  Top 0.203: RN6.P$4 236.4,29.65 JP1.9
L2_G1  (1 unrouted)
  Bottom 0.203: 197.15,22.61 199.8,19.96 228.65,19.96 232.71,24.03 233.53,24.03 235.69,26.19 RN4.P$5
L2_G1_LED
  Bottom 0.203: JP1.8 239.01,32.26 239.01,30.33 238.4,29.72 236.78,29.72 235.69,28.63 RN4.P$4
L2_G2  (1 unrouted)
  Bottom 0.203: 197.56,22.81 200,20.37 228.45,20.37 232.51,24.43 233.32,24.43 234.89,26 RN4.P$6
L2_G2_LED
  Bottom 0.203: JP1.7 236.17,31.95 236.17,29.92 235.56,29.31 235.15,29.31 234.89,29.05 RN4.P$3
L2_G3  (1 unrouted)
  Bottom 0.203: 197.97,23.01 200.2,20.78 228.24,20.78 232.31,24.84 233.12,24.84 234.09,25.81 RN4.P$7
L2_G3_LED
  Bottom 0.203: JP1.6 239.01,34.8 236.98,34.8 235.76,33.58 235.76,30.12 235.36,29.72 234.34,29.72 234.09,29.47 RN4.P$2
L2_G4  (1 unrouted)
  Top 0.203: U1.49 214.72,40.99 215.24,41.5 215.65,41.5
  Bottom 0.203: 198.37,23.22 200.41,21.18 228.04,21.18 233.29,26.44 RN4.P$8
L2_G4_LED
  Bottom 0.203: JP1.5 237.69,36.02 236.78,36.02 235.36,34.59 235.36,30.33 235.15,30.12 233.73,30.12 233.29,29.69 RN4.P$1
L2_R1  (1 unrouted)
  Top 0.203: U1.3 207,39.17 207.31,38.86
  Bottom 0.203: 230.07,43.13 230.48,43.54 232.75,45.6 RN2.P$8
L2_R1_LED
  Bottom 0.203: RN2.P$1 236.14,45.6 239.62,42.11 239.62,41.81 JP1.2
L2_R2  (1 unrouted)
  Top 0.203: U1.4 206.89,38.67 207.31,38.25
  Bottom 0.203: 230.89,42.11 230.89,43.13 232.56,44.8 RN2.P$7
L2_R2_LED
  Bottom 0.203: RN2.P$2 236.33,44.8 239.01,42.11 239.01,39.88 JP1.4
L2_R3  (1 unrouted)
  Top 0.203: U1.5 206.78,38.17 207.52,37.44 207.52,36.63 208.94,35.2
  Bottom 0.203: 231.29,41.71 231.29,42.93 232.37,44 RN2.P$6
L2_R3_LED
  Bottom 0.203: RN2.P$3 236.11,44 236.37,43.74 236.37,42.52 JP1.1
L2_R4  (1 unrouted)
  Top 0.203: U1.6 206.67,37.67 207.11,37.24 207.11,36.42 208.53,35
  Bottom 0.203: 231.7,41.3 231.7,42.72 232.17,43.2 RN2.P$5
L2_R4_LED
  Bottom 0.203: RN2.P$4 235.55,40.81 JP1.3
MISO  (via drill 0.38)  (1 unrouted)
  Top 0.203: IC3.2 219.93,32.95 v219.91,32.97 | v216.66,36.02 216.32,35.67 U1.39
  Bottom 0.203: v219.91,32.97 222.35,35.41 222.35,36.02 221.34,37.03 217.68,37.03 v216.66,36.02
MOSI  (1 unrouted)
  Top 0.203: U1.38 216.83,35.17 217.27,35.61 217.27,38.05 217.88,38.66 222.15,38.66 222.48,38.33 IC3.5
N$1
  Top 0.203: U1.57 210.72,41.96 209.75,42.93 208.68,42.93 Q1.1 207.91,43.05 C2.1
N$2
  Top 0.203: U1.56 211.22,42.07 210.36,42.93 210.36,43.45 Q1.3 212.28,45.36 C1.1
N$3  (via drill 0.38)
  Top 0.203: U1.60 209.22,40.16 v209.14,40.08 | v205.08,39.67 C5.1
  Bottom 0.203: v209.14,40.08 205.49,40.08 v205.08,39.67
N$4  (3 unrouted)
N$5  (3 unrouted)
N$6
  Top 0.203: C6.1 209.72,29.14 U1.22 U1.21
N$7
  Top 0.203: C7.2 204.42,36.67 U1.8
N$8
  Top 0.203: C8.2 204.42,36.17 U1.9
N$9
  Top 0.203: C7.1 202.64,36.42 202.64,34.39 202.44,34.19 199.8,34.19 199.09,34.89 B1.3
N$10
  Top 0.203: B1.4 200.51,35.41 C8.1
N$12
  Top 0.203: B1.1 185.08,37.12 179.27,42.93 179.27,44.15 C9.2 ANT1.FEED
RESET  (via drill 0.43)  (1 unrouted)
  Top 0.203: v212.6,48.82 212.6,47.22 S1.3 211.68,47.09 210.16,48.62 205.49,48.62 v203.05,46.18 | v203.25,32.97 204.95,34.67 U1.12
  Bottom 0.203: v212.6,48.82 215.59,45.82 R2.1 | v203.05,46.18 203.05,36.83 203.25,36.63 v203.25,32.97
ROW1  (via drill 0.38)
  Top 0.203: IC6.15 164.44,19.22 164.44,19.96 164.85,20.37 196.34,20.37 201.42,25.45 v201.62,25.45 | U1.14 205.78,33.67 203.86,31.75 202.44,31.75 v202.23,31.95
  Bottom 0.203: v201.62,25.45 200.81,26.26 200.81,30.12 201.42,30.73 201.42,31.34 202.03,31.95 v202.23,31.95
ROW1_LED  (via drill 0.43, 0.6)
  Top 0.356: D1.4 232.51,11.02 235.36,13.87 | 235.36,13.87 237.79,16.31 238.2,16.31 239.42,17.53 240.23,17.53 240.23,18.34 JP1.20 | v232.92,22.61 235.36,20.17 235.36,13.87 | IC6.16 166.05,19.56 v177.04,19.56
  Top 0.406: D1.4_TOP 231.61,8.95 D1.4 | D2.4_TOP 224.25,8.95 D2.4 | D3.4_TOP 216.88,8.95 D3.4 | D4.4_TOP 209.51,8.95 D4.4
  Bottom 0.356: v177.04,19.56 177.24,19.35 229.67,19.35 v232.92,22.61
  Bottom 0.406: D1.4_BOTTOM 233.36,9 D1.4 229.67,9.8 229.26,9.4 225.6,9.4 D2.4 | D2.4_BOTTOM 226,9 D2.4 | D3.4_BOTTOM 218.63,9 D3.4 | D4.4_BOTTOM 211.26,9 D4.4 D3.4 | D2.4 D3.4 | D2.4
  pour Bottom (no thermals): 206.5,14.88 235.56,14.88 235.56,2.08 206.5,2.08 206.5,14.68
  pour Top (no thermals): 206.5,2.08 206.5,14.88 235.56,14.88 235.56,2.08
ROW2  (via drill 0.38)
  Top 0.203: IC6.13 163.46,20.78 196.14,20.78 201.62,26.26 v202.03,26.26 | U1.15 205.89,33.17 204.06,31.34 202.64,31.34 v202.23,30.94
  Bottom 0.203: v202.03,26.26 201.22,27.08 201.22,29.72 202.23,30.73 v202.23,30.94
ROW2_LED  (via drill 0.6)
  Top 0.203: 163.06,18.7 IC6.14
  Top 0.356: 163.06,18.7 163.63,18.14 177.85,18.14 180.95,15.04 D8.4
  Top 0.406: D5.4_TOP 202.15,8.95 D5.4 203.05,13.46 v203.86,14.27 | D6.4_TOP 194.78,8.95 D6.4 | D7.4_TOP 187.42,8.95 D7.4 | D8.4_TOP 180.05,8.98 D8.4
  Bottom 0.356: v203.86,14.27 204.27,14.27 205.08,15.09 235.76,15.09 237.59,16.92 237.74,17.07 JP1.19
  Bottom 0.406: D5.4_BOTTOM 203.9,9 D5.4 D6.4 | D6.4_BOTTOM 196.53,9 D6.4 | D7.4_BOTTOM 189.17,9 D7.4 | D8.4_BOTTOM 181.8,9.03 181.1,9.73 | 181.1,9.73 D8.4 | 181.1,9.73 188.19,9.73 D7.4 | D6.4 D7.4
  pour Bottom (no thermals): 176.83,14.88 205.89,14.88 205.89,2.08 176.83,2.08 176.83,14.68
  pour Top (no thermals): 177.24,2.08 177.24,14.88 205.89,14.88 205.89,2.08
ROW3  (via drill 0.38)
  Top 0.203: IC6.11 161.33,21.18 195.94,21.18 202.03,27.28 v202.44,27.28 | U1.16 206,32.67 204.06,30.73 203.25,30.73 v202.23,29.72
  Bottom 0.203: v202.44,27.28 201.62,28.09 201.62,29.11 v202.23,29.72
ROW3_LED  (via drill 0.6)
  Top 0.203: 160.58,19.05 IC6.12
  Top 0.356: 160.58,19.05 160.58,17.93 161.19,17.32 170.74,17.32 173.58,14.48 | 173.58,14.48 D9.4 | v178.26,14.48 173.58,14.48
  Top 0.406: D9.4_TOP 172.68,8.95 D9.4 | D10.4_TOP 165.32,8.95 D10.4 | D11.4_TOP 157.95,8.95 D11.4 | D12.4_TOP 150.59,8.95 D12.4
  Bottom 0.203: 238.4,19.56 236.98,19.56
  Bottom 0.356: v178.26,14.48 178.87,14.48 180.09,15.7 235.36,15.7 236.17,16.51 236.17,18.95 236.78,19.56 236.98,19.56 | 238.4,19.56 238.81,19.56 240.03,20.78 240.23,20.78 JP1.18
  Bottom 0.406: D9.4_BOTTOM 174.43,9 D9.4 D10.4 | D10.4_BOTTOM 167.07,9 D10.4 | D11.4_BOTTOM 159.7,9 D11.4 | D12.4_BOTTOM 152.34,9 D12.4 D11.4 | D10.4 D11.4
  pour Bottom (no thermals): 147.37,14.88 176.43,14.88 176.43,2.08 147.37,2.08 147.37,14.68
  pour Top (no thermals): 147.78,2.08 147.78,14.88 176.43,14.88 176.43,2.08
ROW4  (via drill 0.38)
  Top 0.203: IC6.9 159.19,21.59 195.73,21.59 202.44,28.3 v202.84,28.3 | U1.17 205.86,31.92 203.86,29.92 v203.45,29.92
  Bottom 0.203: v202.84,28.3 203.25,28.7 203.25,29.72 v203.45,29.92
ROW4_LED  (via drill 0.6)
  Top 0.356: 154.02,15.15 152.94,14.07 145.14,14.07 144.12,13.06 D13.4 | v159.97,15.09 159.91,15.15 154.02,15.15 | 154.02,15.15 156.4,17.53 157.12,17.53 157.98,18.38 IC6.10
  Top 0.406: D13.4_TOP 143.22,8.95 D13.4 | D14.4_TOP 135.85,8.95 D14.4 | D15.4_TOP 128.23,8.95 D15.4 | D16.4_TOP 120.87,8.95 D16.4
  Bottom 0.356: v159.97,15.09 161.39,15.09 161.8,15.49 178.87,15.49 179.68,16.31 234.75,16.31 235.36,16.92 235.36,19.15 236.98,20.78 237.59,20.78 237.64,20.83 JP1.17
  Bottom 0.406: D13.4_BOTTOM 144.97,9 D13.4 D14.4 | D14.4_BOTTOM 137.6,9 D14.4 | D15.4_BOTTOM 129.98,9 D15.4 | D16.4_BOTTOM 122.62,9 D16.4 D15.4 | D14.4 D15.4
  pour Bottom (no thermals): 117.91,14.88 146.96,14.88 146.96,2.08 117.91,2.08 117.91,14.68
  pour Top (no thermals): 118.11,2.08 118.11,14.88 146.96,14.88 146.96,2.08
ROW5
  Top 0.203: IC7.15 151.27,22 195.53,22 202.64,29.11 203.66,29.11 205.89,31.34 207.52,31.34 207.72,31.55 U1.18
ROW5_LED  (via drill 0.6)
  Top 0.356: D17.4 114.4,13.21 116.08,14.88 145.43,14.88 146.6,16.06 147.53,16.06 | v152.86,16.1 152.81,16.06 147.53,16.06 | 147.53,16.06 149.61,18.14 149.61,19.06 IC7.16
  Top 0.406: D17.4_TOP 113.5,8.95 D17.4 | D18.4_TOP 106.39,8.95 D18.4 | D19.4_TOP 99.02,8.95 D19.4 | D20.4_TOP 91.66,8.95 D20.4
  Bottom 0.203: 238.63,22.1 236.8,22.1
  Bottom 0.356: v152.86,16.1 178.46,16.1 179.27,16.92 234.14,16.92 234.54,17.32 234.54,19.35 236.37,21.18 236.37,21.79 236.68,22.1 236.8,22.1 | 238.63,22.1 238.91,22.1 240.23,23.42 JP1.16
  Bottom 0.406: D17.4_BOTTOM 115.25,9 D17.4 D18.4 | D18.4_BOTTOM 108.14,9 D18.4 | D19.4_BOTTOM 100.77,9 D19.4 | D20.4_BOTTOM 93.41,9 D20.4 D19.4 | D18.4 D19.4
  pour Bottom (no thermals): 88.44,14.88 117.5,14.88 117.5,2.08 88.44,2.08 88.44,14.68
  pour Top (no thermals): 88.65,2.08 88.65,14.88 117.5,14.88 117.5,2.08
ROW6  (via drill 0.38)
  Top 0.203: IC7.13 149.13,22.4 195.33,22.4 199.59,26.67 v199.59,27.28 | U1.19 208.22,31.44 207.72,30.94 206.3,30.94 205.49,30.12 v205.49,29.72
  Bottom 0.203: v199.59,27.28 200.41,26.47 200.41,26.06 200.81,25.65 200.81,25.04 201.22,24.64 201.83,24.64 202.84,25.65 202.84,26.47 203.66,27.28 203.66,28.5 204.88,29.72 v205.49,29.72
ROW6_LED  (via drill 0.6)
  Top 0.356: D21.4 85.19,13.67 87.02,15.49 144.31,15.49 v146.28,17.47 146.3,17.47 147.17,18.34 147.17,19.05 IC7.14
  Top 0.406: D21.4_TOP 84.29,8.95 D21.4 | D22.4_TOP 76.93,8.95 D22.4 | D23.4_TOP 69.56,8.95 D23.4 | D24.4_TOP 62.19,8.95 D24.4
  Bottom 0.356: v146.28,17.47 146.95,18.14 174.8,18.14 176.02,16.92 178.26,16.92 178.87,17.53 233.53,17.53 233.73,17.73 233.73,19.56 235.56,21.39 235.56,22.2 236.78,23.42 237.79,23.42 JP1.15
  Bottom 0.406: D21.4_BOTTOM 86.04,9 D21.4 D22.4 | D22.4_BOTTOM 78.68,9 D22.4 | D23.4_BOTTOM 71.31,9 D23.4 | D24.4_BOTTOM 63.94,9 D24.4 D23.4 | D22.4 D23.4
  pour Bottom (no thermals): 58.98,14.88 88.04,14.88 88.04,2.08 58.98,2.08 58.98,14.68
  pour Top (no thermals): 59.39,2.08 59.39,14.88 88.04,14.88 88.04,2.08
ROW7  (via drill 0.38)
  Top 0.203: IC7.11 147,22.81 195.12,22.81 198.58,26.26 v198.58,26.67 | v213,28.09 214.22,29.31 U1.31
  Bottom 0.203: v198.58,26.67 198.78,26.47 199.8,26.47 200,26.26 200,25.86 200.41,25.45 200.41,24.84 201.02,24.23 202.03,24.23 203.25,25.45 203.25,26.26 204.06,27.08 204.06,28.3 204.67,28.91 213,28.91 v213,28.09
ROW7_LED  (via drill 0.6)
  Top 0.356: D25.4 55.73,14.48 57.35,16.1 141.56,16.1 v142.99,17.53 v143,17.53 143.71,17.53 144.57,18.38 IC7.12
  Top 0.406: D25.4_TOP 54.83,8.95 D25.4 | D26.4_TOP 47.46,8.95 D26.4 | D27.4_TOP 40.1,8.95 D27.4 | D28.4_TOP 32.73,8.95 D28.4
  Bottom 0.203: 236.98,24.64 238.61,24.64
  Bottom 0.356: v142.99,17.53 144.21,18.75 175.21,18.75 176.43,17.53 177.85,17.53 178.46,18.14 232.71,18.14 232.92,18.34 232.92,19.96 234.75,21.79 234.75,22.81 236.58,24.64 236.98,24.64 | 238.61,24.64 239.83,25.86 240.23,25.86 JP1.14
  Bottom 0.406: D25.4_BOTTOM 56.58,9 D25.4 D26.4 | D26.4_BOTTOM 49.21,9 D26.4 | D27.4_BOTTOM 41.85,9 D27.4 | D28.4_BOTTOM 34.48,9 D28.4 D27.4 | D26.4 D27.4
  pour Bottom (no thermals): 29.51,14.88 58.57,14.88 58.57,2.08 29.51,2.08 29.51,14.68
  pour Top (no thermals): 29.92,2.08 29.92,14.88 58.57,14.88 58.57,2.08
ROW8  (via drill 0.38)
  Top 0.203: IC7.9 144.87,23.22 194.92,23.22 197.72,26.02 197.36,26.38 v197.36,26.47 | v213.61,27.28 214.72,28.39 U1.32
  Bottom 0.203: v197.36,26.47 197.97,25.86 199.39,25.86 200,25.25 200,24.64 200.81,23.83 202.23,23.83 203.66,25.25 203.66,26.06 204.47,26.87 204.47,28.09 204.88,28.5 211.99,28.5 212.19,28.3 212.19,27.69 212.6,27.28 v213.61,27.28
ROW8_LED  (via drill 0.6)
  Top 0.203: 26.26,10.01 D29.4
  Top 0.356: 26.26,10.01 27.89,11.63 27.89,13.46 31.14,16.71 139.63,16.71 v140.48,17.56 140.51,17.53 141.27,17.53 142.03,18.28 IC7.10
  Top 0.406: D29.4_TOP 25.36,8.95 D29.4 | D30.4_TOP 18,8.95 D30.4 | D31.4_TOP 10.63,8.95 D31.4 | D32.4_TOP 3.27,8.95 D32.4
  Bottom 0.356: v140.48,17.56 142.28,19.35 175.62,19.35 176.63,18.34 177.65,18.34 178.05,18.75 231.9,18.75 232.1,18.95 232.1,20.37 233.93,22.2 233.93,23.42 236.37,25.86 237.79,25.86 JP1.13
  Bottom 0.406: D29.4_BOTTOM 27.11,9 D29.4 D30.4 | D30.4_BOTTOM 19.75,9 D30.4 | D31.4_BOTTOM 12.38,9 D31.4 | D32.4_BOTTOM 5.02,9 D32.4 D31.4 | D30.4 D31.4
  pour Bottom (no thermals): 1.07,14.88 29.11,14.88 29.11,2.08 1.07,2.08
  pour Top (no thermals): 1.07,2.08 1.07,14.88 29.11,14.88 29.11,2.08
SCK  (via drill 0.38, 0.43)  (1 unrouted)
  Top 0.203: U1.37 217.15,34.67 v217.47,35 | v221.13,35.81 221.21,35.89 IC3.6
  Bottom 0.203: v217.47,35 220.32,35 v221.13,35.81
VCC_BAT  (1 unrouted)
  Top 0.203: S2.3 222.51,48.21 225.81,48.21 227.23,46.79 227.23,42.11 BAT1.PLUS1